# Altium schematic sheet ETHERNET.SchDoc
size A4; SheetNumber: 3; SheetTotal: 4
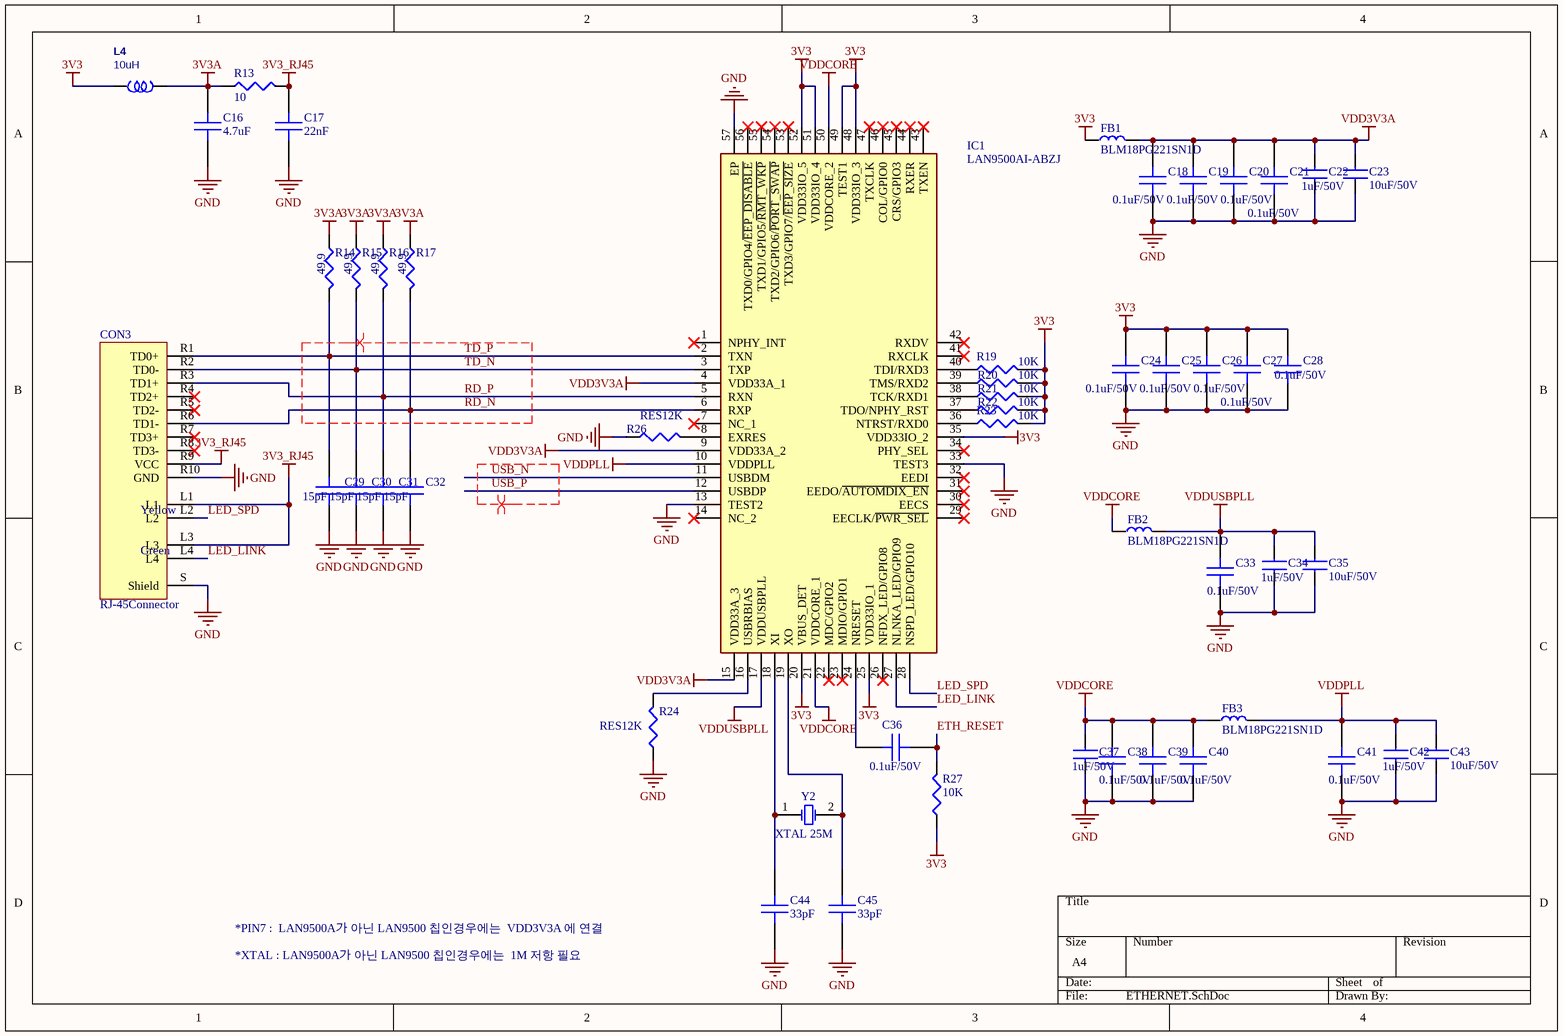
[diagram p0: ETHERNET.SchDoc]

## Parts
C16  4.7uF  [CAP2.2u_0603]
C17  22nF  [CAP2.2u_0603]
C18  0.1uF/50V  [CAP0.1u_0603_ceramic]
C19  0.1uF/50V  [CAP0.1u_0603_ceramic]
C20  0.1uF/50V  [CAP0.1u_0603_ceramic]
C21  0.1uF/50V  [CAP0.1u_0603_ceramic]
C22  1uF/50V  [C-2012]
C23  10uF/50V  [C-2012]
C24  0.1uF/50V  [CAP0.1u_0603_ceramic]
C25  0.1uF/50V  [CAP0.1u_0603_ceramic]
C26  0.1uF/50V  [CAP0.1u_0603_ceramic]
C27  0.1uF/50V  [CAP0.1u_0603_ceramic]
C28  0.1uF/50V  [CAP0.1u_0603_ceramic]
C29  15pF  [CAP2.2u_0603]
C30  15pF  [CAP2.2u_0603]
C31  15pF  [CAP2.2u_0603]
C32  15pF  [CAP2.2u_0603]
C33  0.1uF/50V  [CAP0.1u_0603_ceramic]
C34  1uF/50V  [C-2012]
C35  10uF/50V  [C-2012]
C36  0.1uF/50V  [CAP0.1u_0603_ceramic]
C37  1uF/50V  [C-2012]
C38  0.1uF/50V  [CAP0.1u_0603_ceramic]
C39  0.1uF/50V  [CAP0.1u_0603_ceramic]
C40  0.1uF/50V  [CAP0.1u_0603_ceramic]
C41  0.1uF/50V  [CAP0.1u_0603_ceramic]
C42  1uF/50V  [C-2012]
C43  10uF/50V  [C-2012]
C44  33pF  [CAP33p_0603]
C45  33pF  [CAP33p_0603]
CON3  RJ-45Connector  [[RJ45]24G-1835GYD2NL]
FB1  BLM18PG221SN1D  [BLM18PG221SN1D]
FB2  BLM18PG221SN1D  [BLM18PG221SN1D]
FB3  BLM18PG221SN1D  [BLM18PG221SN1D]
IC1  LAN9500AI-ABZJ  [LAN9500AI-ABZJ]
L4  10uH  [IND10uCoil]
R13  10  [RES20K_0603]
R14  49.9  [RES20K_0603]
R15  49.9  [RES20K_0603]
R16  49.9  [RES20K_0603]
R17  49.9  [RES20K_0603]
R19  10K  [RES20K_0603]
R20  10K  [RES20K_0603]
R21  10K  [RES20K_0603]
R22  10K  [RES20K_0603]
R23  10K  [RES20K_0603]
R24  RES12K  [RES20K_0603]
R26  RES12K  [RES20K_0603]
R27  10K  [RES20K_0603]
Y2  XTAL 25M  [XTAL_SMD_8M]

## Nets
3V3: C24.2 C25.2 C26.2 C27.2 C28.2 FB1.1 IC1.20(VBUS_DET) IC1.25(VDD33IO_1) IC1.35(VDD33IO_2) IC1.48(VDD33IO_3) IC1.49(TEST1) IC1.51(VDD33IO_4) IC1.52(VDD33IO_5) L4.2 R19.2 R20.2 R21.2 R22.2 R23.2 R27.1
3V3_RJ45: C17.2 CON3.L1 CON3.L3 CON3.R9(VCC) R13.2
3V3A: C16.2 L4.1 R13.1 R14.1 R15.1 R16.1 R17.1
GND: C16.1 C17.1 C18.1 C19.1 C20.1 C21.1 C22.2 C23.2 C24.1 C25.1 C26.1 C27.1 C28.1 C29.1 C30.1 C31.1 C32.1 C33.1 C34.2 C35.2 C37.2 C38.1 C39.1 C40.1 C41.1 C42.2 C43.2 C44.1 C45.1 CON3.R10(GND) CON3.S(Shield) IC1.13(TEST2) IC1.33(TEST3) IC1.57(EP) R24.1 R26.1
VDD3V3A: C18.2 C19.2 C20.2 C21.2 C22.1 C23.1 FB1.2 IC1.4(VDD33A_1) IC1.9(VDD33A_2) IC1.15(VDD33A_3)
VDDCORE: C37.1 C38.2 C39.2 C40.2 FB2.1 FB3.1 IC1.21(VDDCORE_1) IC1.50(VDDCORE_2)
VDDPLL: C41.2 C42.1 C43.1 FB3.2 IC1.10(VDDPLL)
VDDUSBPLL: C33.2 C34.1 C35.1 FB2.2 IC1.17(VDDUSBPLL)
ETH_RESET: C36.1 R27.2
LED_LINK: CON3.L4 IC1.27(NLNKA_LED/GPIO9)
LED_SPD: CON3.L2 IC1.28(NSPD_LED/GPIO10)
RD_N: C32.2 CON3.R6(TD1-) IC1.6(RXP) R17.2
RD_P: C31.2 CON3.R3(TD1+) IC1.5(RXN) R16.2
TD_N: C30.2 CON3.R2(TD0-) IC1.3(TXP) R15.2
TD_P: C29.2 CON3.R1(TD0+) IC1.2(TXN) R14.2
USB_N: IC1.11(USBDM)
USB_P: IC1.12(USBDP)
NetC36_2: C36.2 IC1.24(NRESET)
NetC44_2: C44.2 IC1.18(XI) Y2.1(OSC1)
NetC45_2: C45.2 IC1.19(XO) Y2.2(OSC2)
NetIC1_8: IC1.8(EXRES) R26.2
NetIC1_16: IC1.16(USBRBIAS) R24.2
NetIC1_36: IC1.36(NTRST/RXD0) R23.1
NetIC1_37: IC1.37(TDO/NPHY_RST) R22.1
NetIC1_38: IC1.38(TCK/RXD1) R21.1
NetIC1_39: IC1.39(TMS/RXD2) R20.1
NetIC1_40: IC1.40(TDI/RXD3) R19.1

Not connected (* = marked no-connect by the designer): CON3 R4(TD2+)* R5(TD2-)* R7(TD3+)* R8(TD3-)*; IC1 1(NPHY_INT)* 7(NC_1)* 14(NC_2)* 22(MDC/GPIO2)* 23(MDIO/GPIO1)* 26(NFDX_LED/GPIO8)* 29(EECLK/~{PWR_SEL})* 30(EECS)* 31(EEDO/~{AUTOMDIX_EN})* 32(EEDI)* 34(PHY_SEL)* 41(RXCLK)* 42(RXDV)* 43(TXEN)* 44(RXER)* 45(CRS/GPIO3)* 46(COL/GPIO0)* 47(TXCLK)* 53(TXD3/GPIO7/~{EEP_SIZE})* 54(TXD2/GPIO6/~{PORT_SWAP})* 55(TXD1/GPIO5/~{RMT_WKP})* 56(TXD0/GPIO4/~{EEP_DISABLE})*

## Layout directives
differential pair: USB_N, USB_P
differential pair; differential pair class ETH; net class ETH_IO: RD_N, RD_P, TD_N, TD_P

## Notes on the sheet
- *XTAL : LAN9500A가 아닌 LAN9500 칩인경우에는  1M 저항 필요
- *PIN7 :  LAN9500A가 아닌 LAN9500 칩인경우에는  VDD3V3A 에 연결
- (in symbol [RJ45]24G-1835GYD2NL) Yellow; Green

## Library data of the parts
C16 = CAP2.2u_0603: CAP4.7u_0603
C17 = CAP2.2u_0603: CAP22n_0603
C18-C21 C24-C28 C33 C36 C38-C41 = CAP0.1u_0603_ceramic: cap, 0.1u 0603, 50V
C22 C34 C37 C42 = Cap1_1: Capacitor, ceramic, 50V, 0805
C23 C35 C43 = Cap1_1: Capacitor, ceramic, 50V, 1206
C29-C32 = CAP2.2u_0603: CAP15pF_0603
C44 C45 = CAP33p_0603: CAP33p_0603,ceramic
CON3 = [RJ45]24G-1835GYD2NL: [RJ-45] 24G-1835GYD2NL
FB1-FB3 = BLM18PG221SN1D: Ferrite Bead, BLM18PG221SN1D, 0603; Manufacturer_Name: Murata Electronics; Datasheet Link: http://www.murata.com/~/media/webrenewal/support/library/catalog/products/emc/emifil/c31e.ashx?la=en-gb; Height: 0.95mm; Manufacturer_Part_Number: BLM18PG221SN1D; Mouser Part Number: 81-BLM18PG221SN1D; Mouser Price/Stock: https://www.mouser.co.uk/ProductDetail/Murata-Electronics/BLM18PG221SN1D?qs=uSeJpk%2F8In3JS43lpC2ejg%3D%3D; Arrow Part Number: BLM18PG221SN1D; Arrow Price/Stock: https://www.arrow.com/en/products/blm18pg221sn1d/murata-manufacturing?region=europe
IC1 = LAN9500AI-ABZJ: Integrated Circuit, LAN9500AI-ABZJ, Microchip; Datasheet Link: https://componentsearchengine.com/Datasheets/1/LAN9500AI-ABZJ.pdf; Height: 1mm; Manufacturer_Name: Microchip; Manufacturer_Part_Number: LAN9500AI-ABZJ; Mouser Part Number: 886-LAN9500AI-ABZJ; Mouser Price/Stock: https://www.mouser.co.uk/ProductDetail/Microchip-Technology/LAN9500AI-ABZJ?qs=pA5MXup5wxF%2F3MeNLOF5Rg%3D%3D; Arrow Part Number: LAN9500AI-ABZJ; Arrow Price/Stock: https://www.arrow.com/en/products/lan9500ai-abzj/microchip-technology?region=europe
L4 = IND10uCoil: 10uH(2012)
R13 = RES20K: RES10_0603
R14-R17 = RES20K: RES49.9_0603
R19-R23 R27 = RES20K: RES10K_0603
R24 R26 = RES20K: RES12K_0603,1%
Y2 = XTAL8M